# EAGLE design Block_Template (EAGLE 7.3.0)

## Sheet 1 of 2
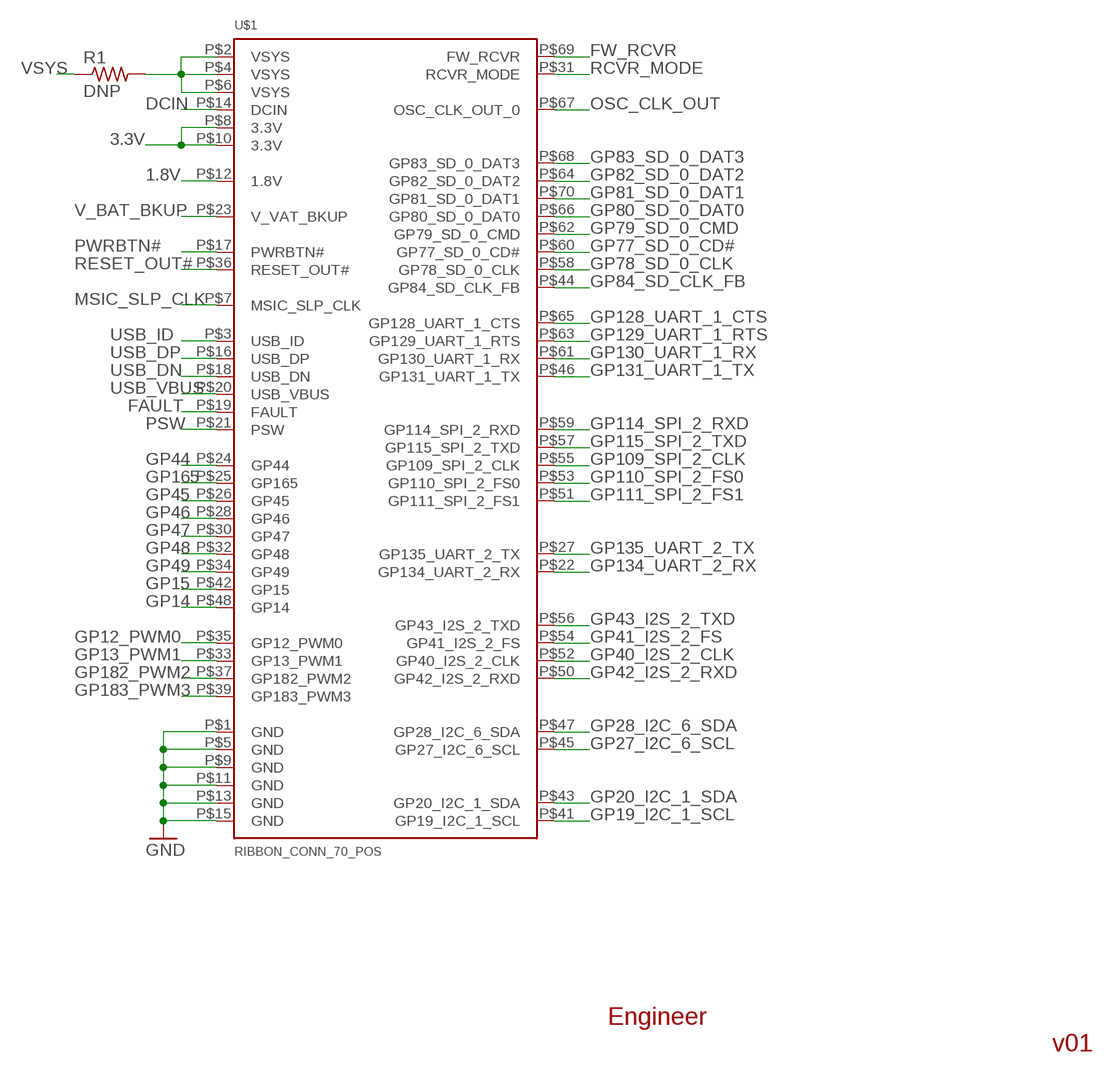
[diagram p0: schematic, sheet 1]

### Parts
R1  DNP  R-US_R0402  [R0402]
U$1  RIBBON_CONN_70_POS  [RIBBON_CONN_70_POS]

### Nets
1.8V: U$1.P$12(1.8V) ; also sheet 2
3.3V: U$1.P$8(3.3V) U$1.P$10(3.3V) ; also sheet 2
DCIN: U$1.P$14(DCIN) ; also sheet 2
FAULT: U$1.P$19(FAULT) ; also sheet 2
FW_RCVR: U$1.P$69(FW_RCVR) ; also sheet 2
GND: U$1.P$1(GND) U$1.P$5(GND) U$1.P$9(GND) U$1.P$11(GND) U$1.P$13(GND) U$1.P$15(GND) ; also sheet 2
GP12_PWM0: U$1.P$35(GP12_PWM0) ; also sheet 2
GP13_PWM1: U$1.P$33(GP13_PWM1) ; also sheet 2
GP14: U$1.P$48(GP14) ; also sheet 2
GP15: U$1.P$42(GP15) ; also sheet 2
GP19_I2C_1_SCL: U$1.P$41(GP19_I2C_1_SCL) ; also sheet 2
GP20_I2C_1_SDA: U$1.P$43(GP20_I2C_1_SDA) ; also sheet 2
GP27_I2C_6_SCL: U$1.P$45(GP27_I2C_6_SCL) ; also sheet 2
GP28_I2C_6_SDA: U$1.P$47(GP28_I2C_6_SDA) ; also sheet 2
GP40_I2S_2_CLK: U$1.P$52(GP40_I2S_2_CLK) ; also sheet 2
GP41_I2S_2_FS: U$1.P$54(GP41_I2S_2_FS) ; also sheet 2
GP42_I2S_2_RXD: U$1.P$50(GP42_I2S_2_RXD) ; also sheet 2
GP43_I2S_2_TXD: U$1.P$56(GP43_I2S_2_TXD) ; also sheet 2
GP44: U$1.P$24(GP44) ; also sheet 2
GP45: U$1.P$26(GP45) ; also sheet 2
GP46: U$1.P$28(GP46) ; also sheet 2
GP47: U$1.P$30(GP47) ; also sheet 2
GP48: U$1.P$32(GP48) ; also sheet 2
GP49: U$1.P$34(GP49) ; also sheet 2
GP77_SD_0_CD#: U$1.P$60(GP77_SD_0_CD#) ; also sheet 2
GP78_SD_0_CLK: U$1.P$58(GP78_SD_0_CLK) ; also sheet 2
GP79_SD_0_CMD: U$1.P$62(GP79_SD_0_CMD) ; also sheet 2
GP80_SD_0_DAT0: U$1.P$66(GP80_SD_0_DAT0) ; also sheet 2
GP81_SD_0_DAT1: U$1.P$70(GP81_SD_0_DAT1) ; also sheet 2
GP82_SD_0_DAT2: U$1.P$64(GP82_SD_0_DAT2) ; also sheet 2
GP83_SD_0_DAT3: U$1.P$68(GP83_SD_0_DAT3) ; also sheet 2
GP84_SD_CLK_FB: U$1.P$44(GP84_SD_CLK_FB) ; also sheet 2
GP109_SPI_2_CLK: U$1.P$55(GP109_SPI_2_CLK) ; also sheet 2
GP110_SPI_2_FS0: U$1.P$53(GP110_SPI_2_FS0) ; also sheet 2
GP111_SPI_2_FS1: U$1.P$51(GP111_SPI_2_FS1) ; also sheet 2
GP114_SPI_2_RXD: U$1.P$59(GP114_SPI_2_RXD) ; also sheet 2
GP115_SPI_2_TXD: U$1.P$57(GP115_SPI_2_TXD) ; also sheet 2
GP128_UART_1_CTS: U$1.P$65(GP128_UART_1_CTS) ; also sheet 2
GP129_UART_1_RTS: U$1.P$63(GP129_UART_1_RTS) ; also sheet 2
GP130_UART_1_RX: U$1.P$61(GP130_UART_1_RX) ; also sheet 2
GP131_UART_1_TX: U$1.P$46(GP131_UART_1_TX) ; also sheet 2
GP134_UART_2_RX: U$1.P$22(GP134_UART_2_RX) ; also sheet 2
GP135_UART_2_TX: U$1.P$27(GP135_UART_2_TX) ; also sheet 2
GP165: U$1.P$25(GP165) ; also sheet 2
GP182_PWM2: U$1.P$37(GP182_PWM2) ; also sheet 2
GP183_PWM3: U$1.P$39(GP183_PWM3) ; also sheet 2
MSIC_SLP_CLK: U$1.P$7(MSIC_SLP_CLK) ; also sheet 2
N$2: R1.2 U$1.P$2(VSYS) U$1.P$4(VSYS) U$1.P$6(VSYS)
OSC_CLK_OUT: U$1.P$67(OSC_CLK_OUT_0) ; also sheet 2
PSW: U$1.P$21(PSW) ; also sheet 2
PWRBTN#: U$1.P$17(PWRBTN#) ; also sheet 2
RCVR_MODE: U$1.P$31(RCVR_MODE) ; also sheet 2
RESET_OUT#: U$1.P$36(RESET_OUT#) ; also sheet 2
USB_DN: U$1.P$18(USB_DN) ; also sheet 2
USB_DP: U$1.P$16(USB_DP) ; also sheet 2
USB_ID: U$1.P$3(USB_ID) ; also sheet 2
USB_VBUS: U$1.P$20(USB_VBUS) ; also sheet 2
V_BAT_BKUP: U$1.P$23(V_VAT_BKUP) ; also sheet 2
VSYS: R1.1 ; also sheet 2

### Notes on the sheet
- Engineer
- v01

## Sheet 2 of 2
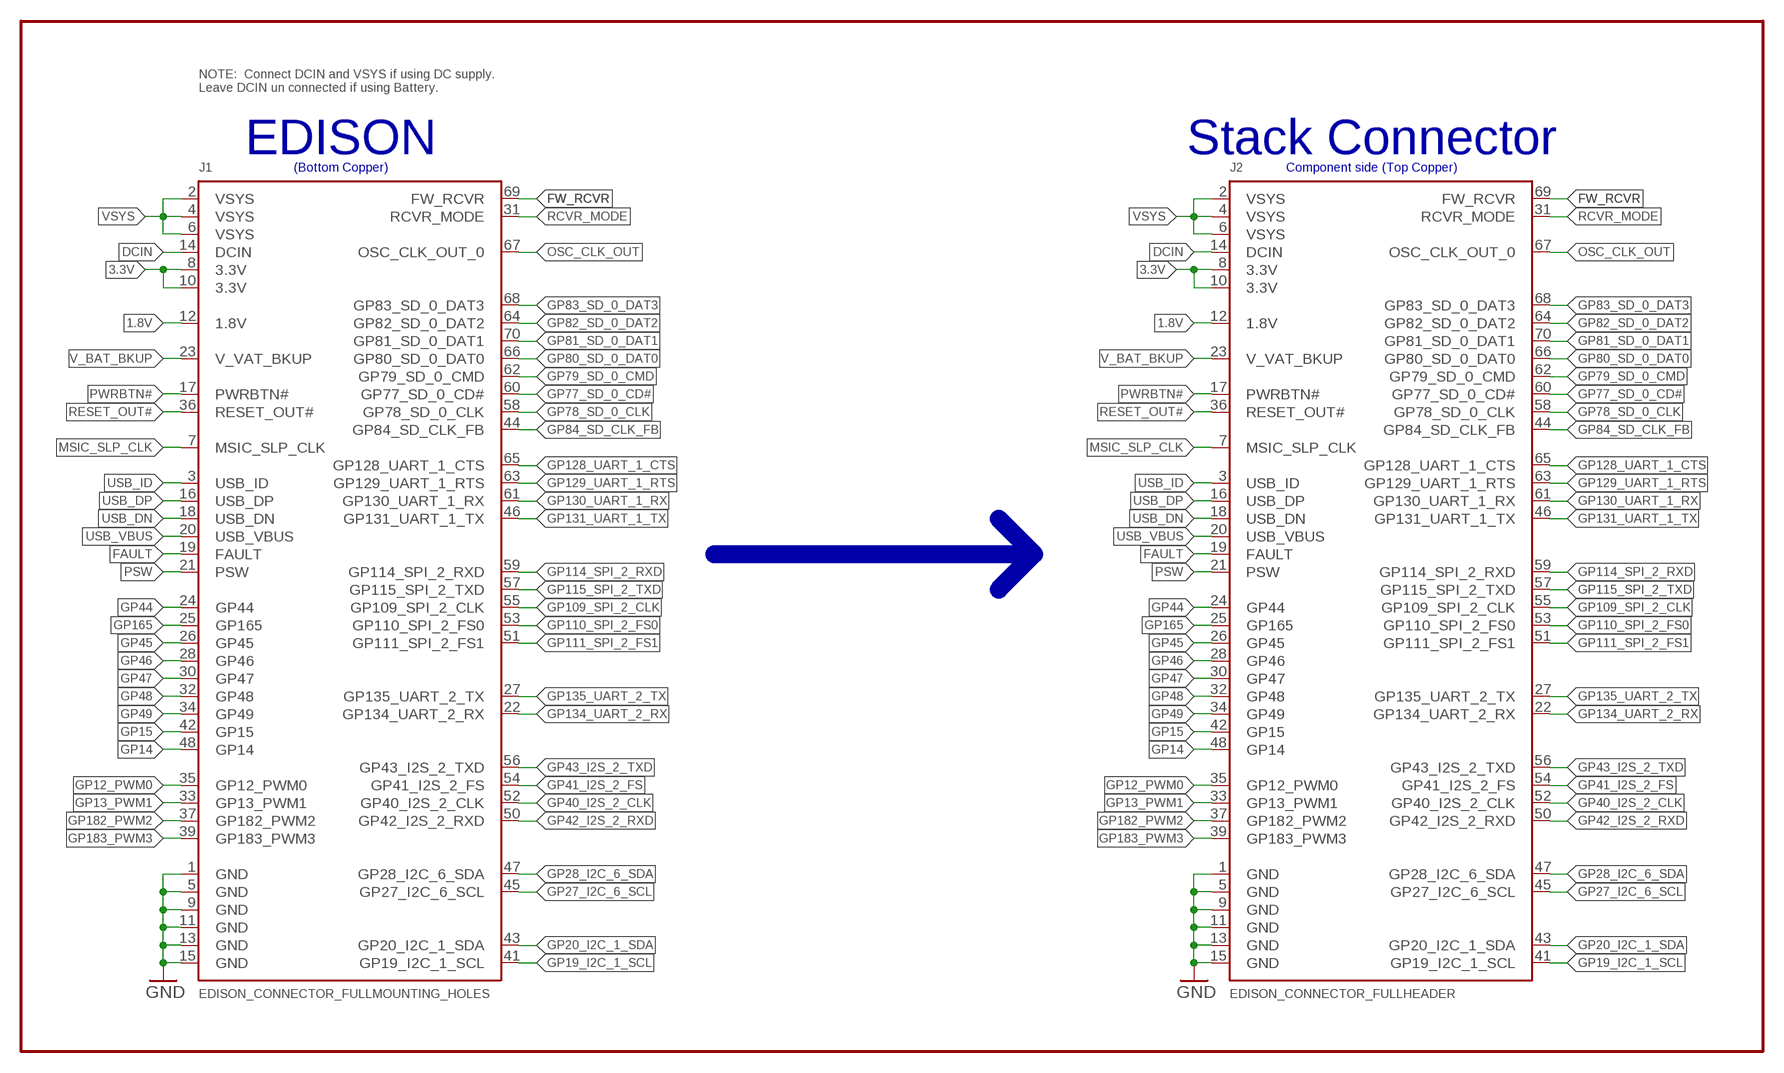
[diagram p1: schematic, sheet 2]

### Parts
J1  EDISON_CONNECTOR_FULLMOUNTING_HOLES  [EDISON_DAUGHTER]
J2  EDISON_CONNECTOR_FULLHEADER  [DF40C-70DP-0.4(51)]

### Nets
1.8V: J1.12(1.8V) J2.12(1.8V) ; also sheet 1
3.3V: J1.8(3.3V) J1.10(3.3V) J2.8(3.3V) J2.10(3.3V) ; also sheet 1
DCIN: J1.14(DCIN) J2.14(DCIN) ; also sheet 1
FAULT: J1.19(FAULT) J2.19(FAULT) ; also sheet 1
FW_RCVR: J1.69(FW_RCVR) J2.69(FW_RCVR) ; also sheet 1
GND: J1.1(GND) J1.5(GND) J1.9(GND) J1.11(GND) J1.13(GND) J1.15(GND) J2.1(GND) J2.5(GND) J2.9(GND) J2.11(GND) J2.13(GND) J2.15(GND) ; also sheet 1
GP12_PWM0: J1.35(GP12_PWM0) J2.35(GP12_PWM0) ; also sheet 1
GP13_PWM1: J1.33(GP13_PWM1) J2.33(GP13_PWM1) ; also sheet 1
GP14: J1.48(GP14) J2.48(GP14) ; also sheet 1
GP15: J1.42(GP15) J2.42(GP15) ; also sheet 1
GP19_I2C_1_SCL: J1.41(GP19_I2C_1_SCL) J2.41(GP19_I2C_1_SCL) ; also sheet 1
GP20_I2C_1_SDA: J1.43(GP20_I2C_1_SDA) J2.43(GP20_I2C_1_SDA) ; also sheet 1
GP27_I2C_6_SCL: J1.45(GP27_I2C_6_SCL) J2.45(GP27_I2C_6_SCL) ; also sheet 1
GP28_I2C_6_SDA: J1.47(GP28_I2C_6_SDA) J2.47(GP28_I2C_6_SDA) ; also sheet 1
GP40_I2S_2_CLK: J1.52(GP40_I2S_2_CLK) J2.52(GP40_I2S_2_CLK) ; also sheet 1
GP41_I2S_2_FS: J1.54(GP41_I2S_2_FS) J2.54(GP41_I2S_2_FS) ; also sheet 1
GP42_I2S_2_RXD: J1.50(GP42_I2S_2_RXD) J2.50(GP42_I2S_2_RXD) ; also sheet 1
GP43_I2S_2_TXD: J1.56(GP43_I2S_2_TXD) J2.56(GP43_I2S_2_TXD) ; also sheet 1
GP44: J1.24(GP44) J2.24(GP44) ; also sheet 1
GP45: J1.26(GP45) J2.26(GP45) ; also sheet 1
GP46: J1.28(GP46) J2.28(GP46) ; also sheet 1
GP47: J1.30(GP47) J2.30(GP47) ; also sheet 1
GP48: J1.32(GP48) J2.32(GP48) ; also sheet 1
GP49: J1.34(GP49) J2.34(GP49) ; also sheet 1
GP77_SD_0_CD#: J1.60(GP77_SD_0_CD#) J2.60(GP77_SD_0_CD#) ; also sheet 1
GP78_SD_0_CLK: J1.58(GP78_SD_0_CLK) J2.58(GP78_SD_0_CLK) ; also sheet 1
GP79_SD_0_CMD: J1.62(GP79_SD_0_CMD) J2.62(GP79_SD_0_CMD) ; also sheet 1
GP80_SD_0_DAT0: J1.66(GP80_SD_0_DAT0) J2.66(GP80_SD_0_DAT0) ; also sheet 1
GP81_SD_0_DAT1: J1.70(GP81_SD_0_DAT1) J2.70(GP81_SD_0_DAT1) ; also sheet 1
GP82_SD_0_DAT2: J1.64(GP82_SD_0_DAT2) J2.64(GP82_SD_0_DAT2) ; also sheet 1
GP83_SD_0_DAT3: J1.68(GP83_SD_0_DAT3) J2.68(GP83_SD_0_DAT3) ; also sheet 1
GP84_SD_CLK_FB: J1.44(GP84_SD_CLK_FB) J2.44(GP84_SD_CLK_FB) ; also sheet 1
GP109_SPI_2_CLK: J1.55(GP109_SPI_2_CLK) J2.55(GP109_SPI_2_CLK) ; also sheet 1
GP110_SPI_2_FS0: J1.53(GP110_SPI_2_FS0) J2.53(GP110_SPI_2_FS0) ; also sheet 1
GP111_SPI_2_FS1: J1.51(GP111_SPI_2_FS1) J2.51(GP111_SPI_2_FS1) ; also sheet 1
GP114_SPI_2_RXD: J1.59(GP114_SPI_2_RXD) J2.59(GP114_SPI_2_RXD) ; also sheet 1
GP115_SPI_2_TXD: J1.57(GP115_SPI_2_TXD) J2.57(GP115_SPI_2_TXD) ; also sheet 1
GP128_UART_1_CTS: J1.65(GP128_UART_1_CTS) J2.65(GP128_UART_1_CTS) ; also sheet 1
GP129_UART_1_RTS: J1.63(GP129_UART_1_RTS) J2.63(GP129_UART_1_RTS) ; also sheet 1
GP130_UART_1_RX: J1.61(GP130_UART_1_RX) J2.61(GP130_UART_1_RX) ; also sheet 1
GP131_UART_1_TX: J1.46(GP131_UART_1_TX) J2.46(GP131_UART_1_TX) ; also sheet 1
GP134_UART_2_RX: J1.22(GP134_UART_2_RX) J2.22(GP134_UART_2_RX) ; also sheet 1
GP135_UART_2_TX: J1.27(GP135_UART_2_TX) J2.27(GP135_UART_2_TX) ; also sheet 1
GP165: J1.25(GP165) J2.25(GP165) ; also sheet 1
GP182_PWM2: J1.37(GP182_PWM2) J2.37(GP182_PWM2) ; also sheet 1
GP183_PWM3: J1.39(GP183_PWM3) J2.39(GP183_PWM3) ; also sheet 1
MSIC_SLP_CLK: J1.7(MSIC_SLP_CLK) J2.7(MSIC_SLP_CLK) ; also sheet 1
OSC_CLK_OUT: J1.67(OSC_CLK_OUT_0) J2.67(OSC_CLK_OUT_0) ; also sheet 1
PSW: J1.21(PSW) J2.21(PSW) ; also sheet 1
PWRBTN#: J1.17(PWRBTN#) J2.17(PWRBTN#) ; also sheet 1
RCVR_MODE: J1.31(RCVR_MODE) J2.31(RCVR_MODE) ; also sheet 1
RESET_OUT#: J1.36(RESET_OUT#) J2.36(RESET_OUT#) ; also sheet 1
USB_DN: J1.18(USB_DN) J2.18(USB_DN) ; also sheet 1
USB_DP: J1.16(USB_DP) J2.16(USB_DP) ; also sheet 1
USB_ID: J1.3(USB_ID) J2.3(USB_ID) ; also sheet 1
USB_VBUS: J1.20(USB_VBUS) J2.20(USB_VBUS) ; also sheet 1
V_BAT_BKUP: J1.23(V_VAT_BKUP) J2.23(V_VAT_BKUP) ; also sheet 1
VSYS: J1.2(VSYS) J1.4(VSYS) J1.6(VSYS) J2.2(VSYS) J2.4(VSYS) J2.6(VSYS) ; also sheet 1

### Buses
B$1

### Notes on the sheet
- NOTE:  Connect DCIN and VSYS if using DC supply.
  Leave DCIN un connected if using Battery.
- EDISON | Stack Connector
- (Bottom Copper) | Component side (Top Copper)

## Library data of the parts
J1 J2 = Edison:EDISON_CONNECTOR_FULL
R1 = rcl:R-US_: RESISTOR, American symbol
U$1 = kinetic:RIBBON_CONN_70_POS

## Board
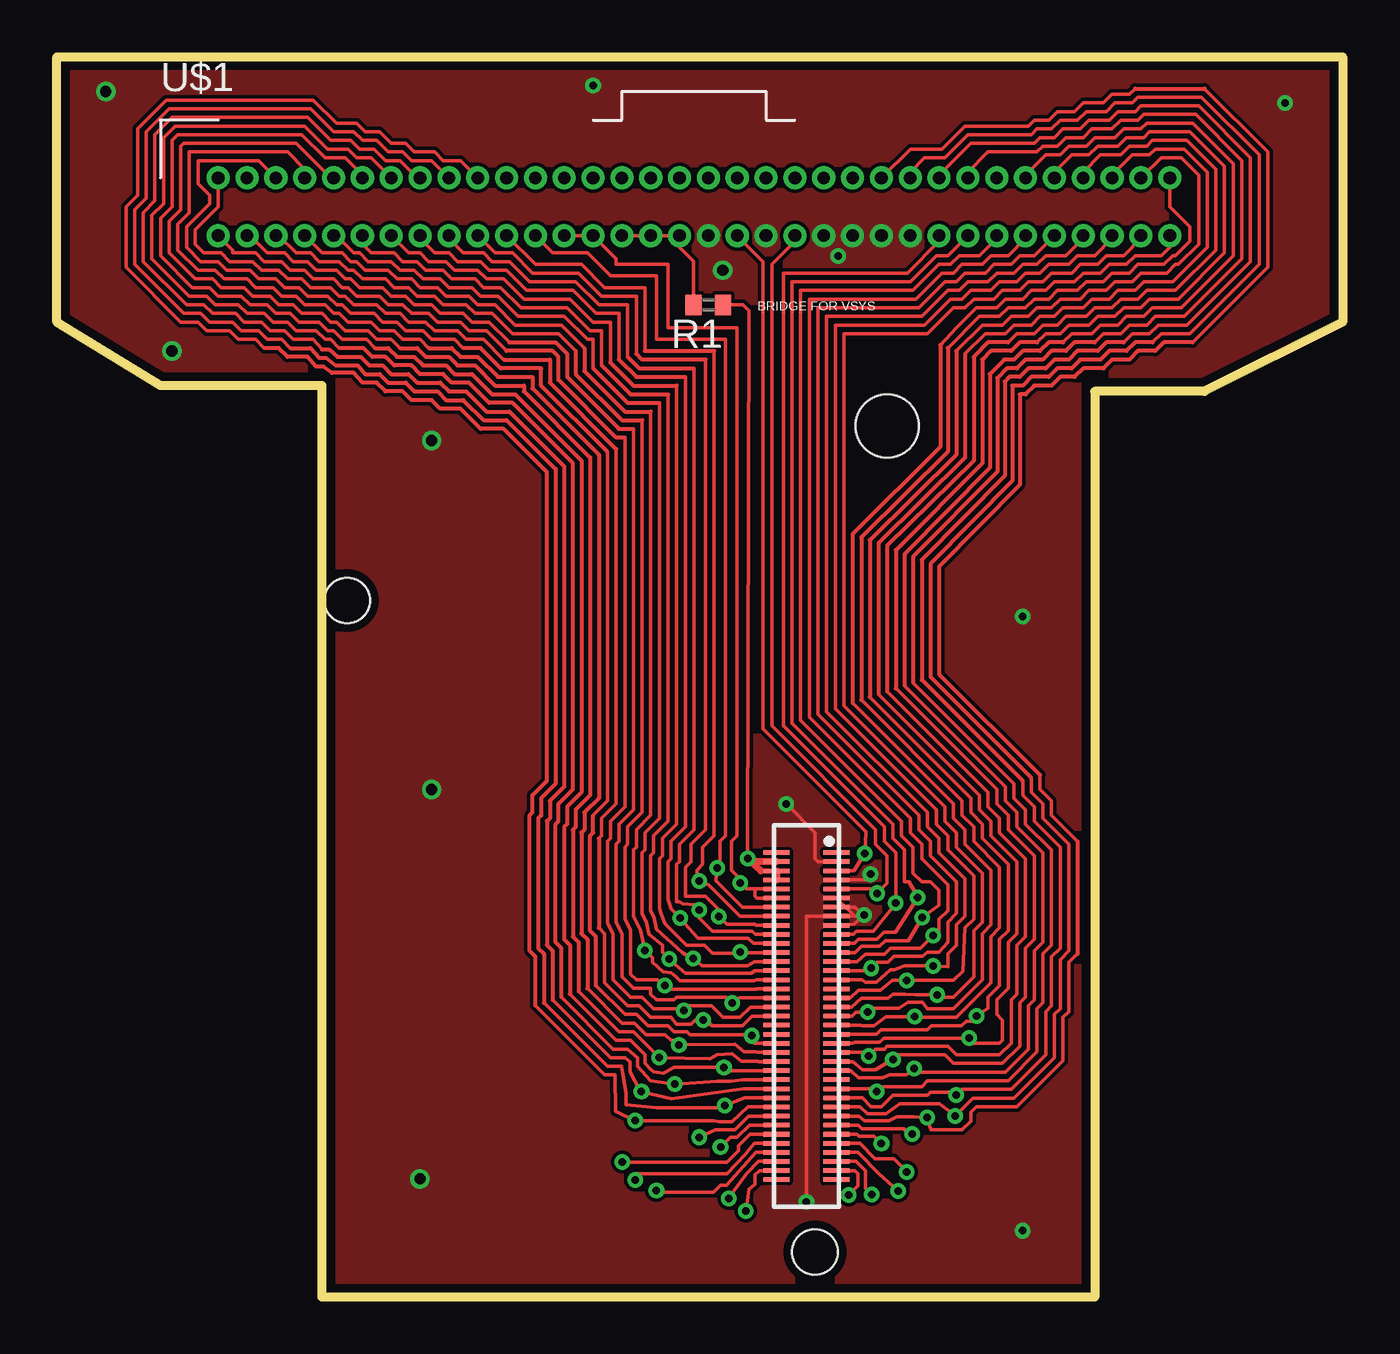
[diagram p2: board, top side]
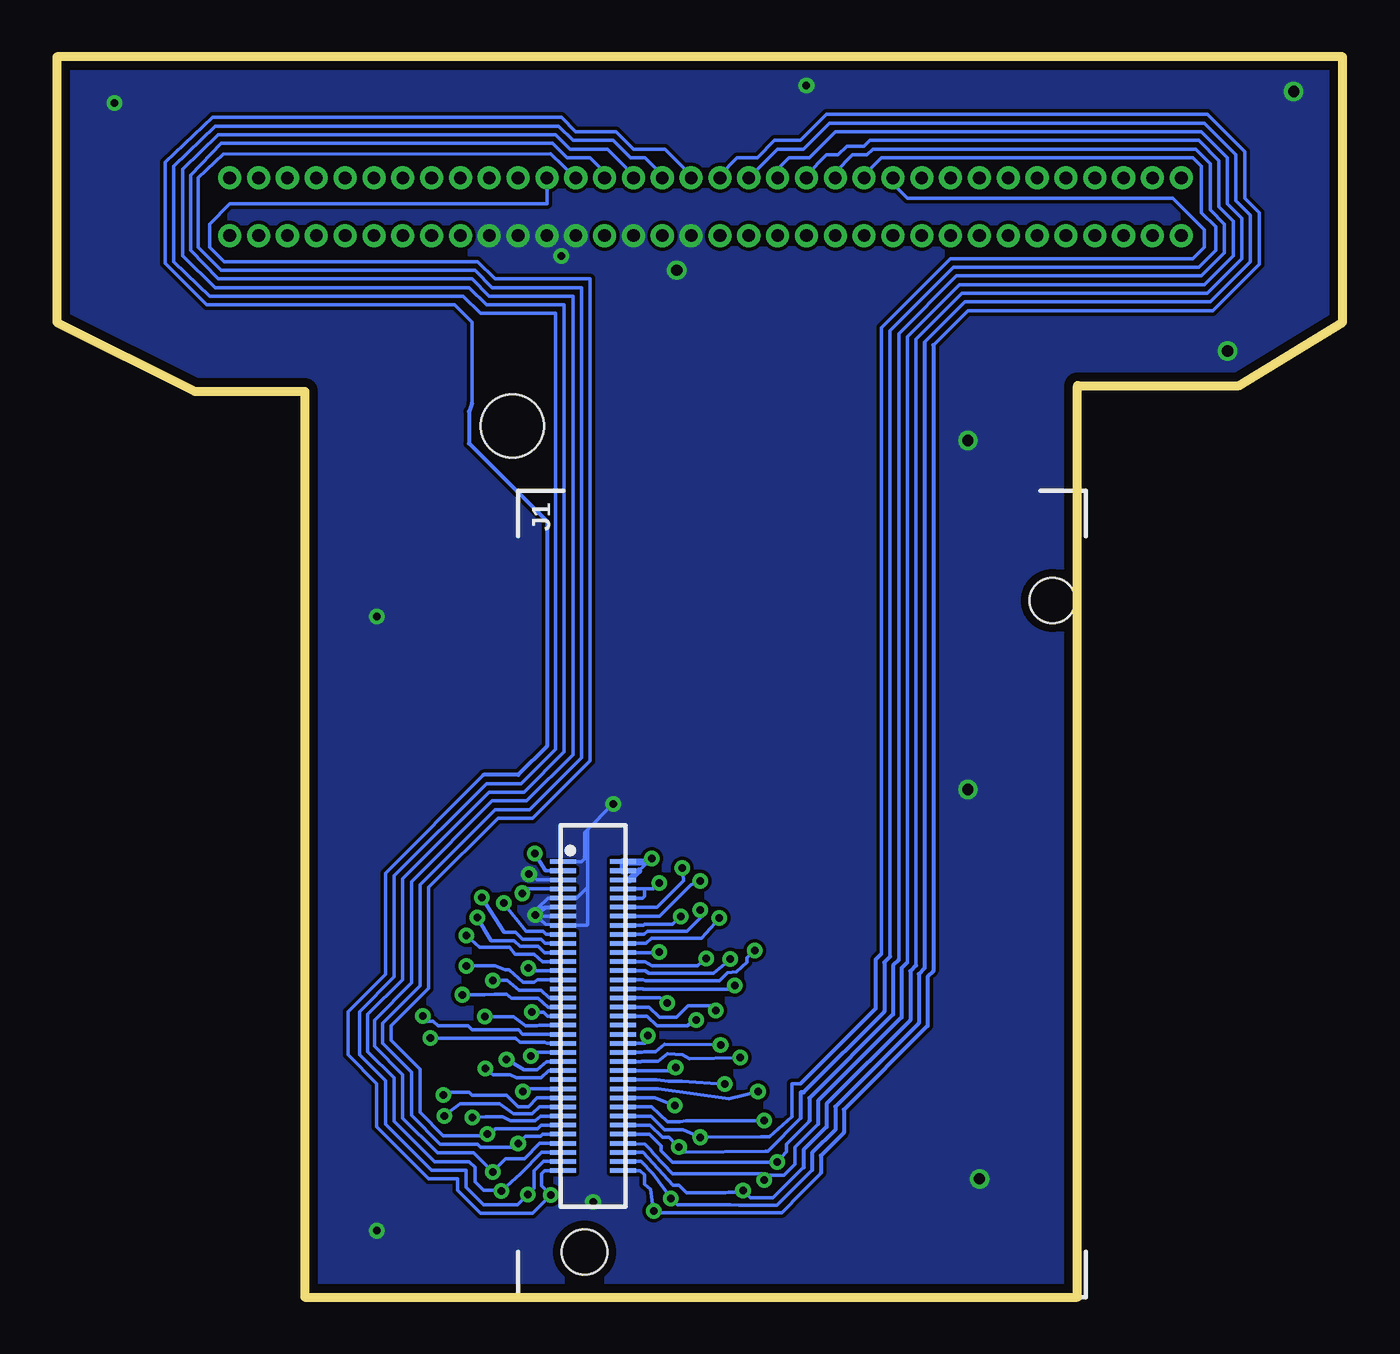
[diagram p3: board, bottom side, seen from below]

Size 56.64 x 54.61 mm. Coordinates in mm from the lower left corner, seen from the top.
Outline: 45.72,39.88 45.72,0 11.68,0 11.68,40.13 4.57,40.13 0,42.93 0,54.61 56.64,54.61 56.64,42.93 50.55,39.88 45.72,39.88
Copper layers (1*16): Top 0.035mm / dielectric 1.5mm / Bottom 0.035mm
Design rules "SparkFun-2-layer *": minimum track width 6mil, minimum drill 13mil, track to track 6mil, track to pad 6mil, pad to pad 6mil, via to via 6mil, smd to smd 6mil, copper to edge 15mil, drill to drill 7mil, minimum pad ring 8mil, minimum via ring 7mil, stop-mask expansion 4mil, vias tented up to drill 20mil, thermal gap 6mil
Holes 2.8 mm at 36.58,38.35

### Footprints (pad centres in the part's own frame; a part is rotated, then mirrored left to right if it is on the bottom)
EDISON_DAUGHTER = smd 1.14 x 0.2: 1 1.98,19.17; 2 4.62,19.17; 3 1.98,18.77; 4 4.62,18.77; 5 1.98,18.37; 6 4.62,18.37; 7 1.98,17.97; 8 4.62,17.97; 9 1.98,17.57; 10 4.62,17.57; 11 1.98,17.17; 12 4.62,17.17; 13 1.98,16.77; 14 4.62,16.77; 15 1.98,16.37; 16 4.62,16.37; 17 1.98,15.97; 18 4.62,15.97; 19 1.98,15.57; 20 4.62,15.57; 21 1.98,15.17; 22 4.62,15.17; 23 1.98,14.77; 24 4.62,14.77; 25 1.98,14.37; 26 4.62,14.37; 27 1.98,13.97; 28 4.62,13.97; 29 1.98,13.57; 30 4.62,13.57; 31 1.98,13.17; 32 4.62,13.17; 33 1.98,12.77; 34 4.62,12.77; 35 1.98,12.37; 36 4.62,12.37; 37 1.98,11.97; 38 4.62,11.97; 39 1.98,11.57; 40 4.62,11.57; 41 1.98,11.17; 42 4.62,11.17; 43 1.98,10.77; 44 4.62,10.77; 45 1.98,10.37; 46 4.62,10.37; 47 1.98,9.97; 48 4.62,9.97; 49 1.98,9.57; 50 4.62,9.57; 51 1.98,9.17; 52 4.62,9.17; 53 1.98,8.77; 54 4.62,8.77; 55 1.98,8.37; 56 4.62,8.37; 57 1.98,7.97; 58 4.62,7.97; 59 1.98,7.57; 60 4.62,7.57; 61 1.98,7.17; 62 4.62,7.17; 63 1.98,6.77; 64 4.62,6.77; 65 1.98,6.37; 66 4.62,6.37; 67 1.98,5.97; 68 4.62,5.97; 69 1.98,5.57; 70 4.62,5.57 | hole 2: 23.53,30.67; 2.93,1.98
DF40C-70DP-0.4(51) = smd 0.2 x 1.14 bottom: 1 6.8,1.32; 2 6.8,-1.32; 3 6.4,1.32; 4 6.4,-1.32; 5 6,1.32; 6 6,-1.32; 7 5.6,1.32; 8 5.6,-1.32; 9 5.2,1.32; 10 5.2,-1.32; 11 4.8,1.32; 12 4.8,-1.32; 13 4.4,1.32; 14 4.4,-1.32; 15 4,1.32; 16 4,-1.32; 17 3.6,1.32; 18 3.6,-1.32; 19 3.2,1.32; 20 3.2,-1.32; 21 2.8,1.32; 22 2.8,-1.32; 23 2.4,1.32; 24 2.4,-1.32; 25 2,1.32; 26 2,-1.32; 27 1.6,1.32; 28 1.6,-1.32; 29 1.2,1.32; 30 1.2,-1.32; 31 0.8,1.32; 32 0.8,-1.32; 33 0.4,1.32; 34 0.4,-1.32; 35 0,1.32; 36 0,-1.32; 37 -0.4,1.32; 38 -0.4,-1.32; 39 -0.8,1.32; 40 -0.8,-1.32; 41 -1.2,1.32; 42 -1.2,-1.32; 43 -1.6,1.32; 44 -1.6,-1.32; 45 -2,1.32; 46 -2,-1.32; 47 -2.4,1.32; 48 -2.4,-1.32; 49 -2.8,1.32; 50 -2.8,-1.32; 51 -3.2,1.32; 52 -3.2,-1.32; 53 -3.6,1.32; 54 -3.6,-1.32; 55 -4,1.32; 56 -4,-1.32; 57 -4.4,1.32; 58 -4.4,-1.32; 59 -4.8,1.32; 60 -4.8,-1.32; 61 -5.2,1.32; 62 -5.2,-1.32; 63 -5.6,1.32; 64 -5.6,-1.32; 65 -6,1.32; 66 -6,-1.32; 67 -6.4,1.32; 68 -6.4,-1.32; 69 -6.8,1.32; 70 -6.8,-1.32; NC1 7.2,1.32; NC2 7.2,-1.32; NC3 -7.2,-1.32; NC4 -7.2,1.32
R0402 = smd 0.7 x 0.9: 1 -0.65,0; 2 0.65,0
RIBBON_CONN_70_POS = drill 0.559 pad 1.016: P$1 0,-1.27; P$2 -1.27,-1.27; P$3 1.27,-1.27; P$4 -2.54,-1.27; P$5 2.54,-1.27; P$6 -3.81,-1.27; P$7 3.81,-1.27; P$8 -5.08,-1.27; P$9 5.08,-1.27; P$10 -6.35,-1.27; P$11 6.35,-1.27; P$12 -7.62,-1.27; P$13 7.62,-1.27; P$14 -8.89,-1.27; P$15 8.89,-1.27; P$16 -10.16,-1.27; P$17 10.16,-1.27; P$18 -11.43,-1.27; P$19 11.43,-1.27; P$20 -12.7,-1.27; P$21 12.7,-1.27; P$22 -13.97,-1.27; P$23 13.97,-1.27; P$24 -15.24,-1.27; P$25 15.24,-1.27; P$26 -16.51,-1.27; P$27 16.51,-1.27; P$28 -17.78,-1.27; P$30 -19.05,-1.27; P$31 17.78,-1.27; P$32 -20.32,-1.27; P$33 19.05,-1.27; P$34 -21.59,-1.27; P$35 20.32,-1.27; P$36 -21.59,1.27; P$37 20.32,1.27; P$39 19.05,1.27; P$40 -20.32,1.27; P$41 17.78,1.27; P$42 -19.05,1.27; P$43 16.51,1.27; P$44 -17.78,1.27; P$45 15.24,1.27; P$46 -16.51,1.27; P$47 13.97,1.27; P$48 -15.24,1.27; P$49 12.7,1.27; P$50 -13.97,1.27; P$51 11.43,1.27; P$52 -12.7,1.27; P$53 10.16,1.27; P$54 -11.43,1.27; P$55 8.89,1.27; P$56 -10.16,1.27; P$57 7.62,1.27; P$58 -8.89,1.27; P$59 6.35,1.27; P$60 -7.62,1.27; P$61 5.08,1.27; P$62 -6.35,1.27; P$63 3.81,1.27; P$64 -5.08,1.27; P$65 2.54,1.27; P$66 -3.81,1.27; P$67 1.27,1.27; P$68 -2.54,1.27; P$69 0,1.27; P$70 -1.27,1.27

### Placement (x,y rotation side)
J1  36.32,0 0 bottom
J2  33.02,12.37 90 bottom
R1  28.7,43.69 180 top
U$1  28.7,48.01 0 top

### Tracks (layer width: path | path; a pad name or v marks a point on that pad's centre or on a via)
1.8V  (via drill 0.33)
  Top 0.152: J1.12 30.2,17.17 29.03,18.34 v29.08,18.9 29.21,19.07 29.21,20.07 29.46,20.32 29.46,42.16 26.42,42.16 26.42,44.96 24.38,44.96 23.37,45.97 21.84,45.97 U$1.P$12
  Bottom 0.152: v29.08,18.9 29.03,18.34 30.2,17.17 J1.12 | J1.12
3.3V  (via drill 0.33)
  Top 0.152: J1.8 | 30.76,17.97 30.37,17.97 v30.1,18.24 30.1,18.41 29.72,18.8 29.72,20.07 29.97,20.32 29.97,42.67 26.92,42.67 26.92,45.47 24.64,45.47 24.64,45.72 U$1.P$8 U$1.P$10 | 30.76,17.97 J1.8 | J1.10 30.84,17.57 30.76,17.65 30.76,17.97
  Bottom 0.152: J1.8 30.76,17.97 | 30.76,17.97 30.37,17.97 v30.1,18.24 | J1.10 30.84,17.57 30.76,17.65 30.76,17.97
DCIN  (via drill 0.33)
  Top 0.152: J1.14 30.18,16.77 | 30.18,16.77 30.09,16.77 28.7,18.16 v28.3,18.31 28.19,18.21 28.19,18.8 28.45,19.05 28.45,19.81 28.96,20.32 28.96,41.66 | 30.18,16.77 | U$1.P$14 21.08,45.47 23.11,45.47 24.13,44.45 25.91,44.45 25.91,41.66
  Top 0.178: 25.91,41.66 28.96,41.66
  Bottom 0.152: v28.3,18.31 28.7,18.16 30.09,16.77 J1.14
FAULT  (via drill 0.33)
  Top 0.152: J2.19 35.13,15.57 35.31,15.75 36.12,15.75 36.42,16.05 36.93,16.05 v37.92,17.6 37.54,18.29 37.34,18.29 37.34,19.68 36.83,20.19 36.83,20.83 32.39,25.27 32.39,44.7 37.59,44.7 38.73,45.85 39.24,45.85 U$1.P$19
  Bottom 0.152: v37.92,17.6 36.93,16.05 36.42,16.05 36.12,15.75 35.31,15.75 35.13,15.57 J2.19
FW_RCVR  (via drill 0.33)
  Top 0.152: v34.87,4.5 35.28,4.9 35.28,5.44 35.15,5.57 J2.69
  Bottom 0.152: J2.69 35.15,5.57 35.28,5.44 35.28,4.9 v34.87,4.5 35.69,3.68 37.97,3.68 38.99,4.7 38.99,5.21 40.26,5.21 42.55,7.49 42.55,9.4 43.82,10.67 43.82,12.57 42.16,14.22 42.16,18.67 37.85,22.99 | U$1.P$69 28.7,49.4 29.84,50.55 31.24,50.55 32,51.31 33.78,51.31 34.42,51.94 49.78,51.94 51.87,49.96 51.87,45.52 50.04,43.69 39.12,43.69 38.35,42.93 38.35,39.37
  Bottom 0.178: 38.35,39.37 38.48,38.99 38.48,37.59 35.05,34.16 35.05,24.26 36.32,22.99 37.85,22.99
GND  (via drill 0.33, 0.33 pad 0.25, 0.5)
  Top 0.152: 35.33,18.37 35.33,18.36 | 35.33,18.37 35.74,18.37 v35.84,18.62 | 35.33,18.37 J2.5 | J2.1 33.54,19.17 33.4,19.3 33.4,20.45 v32.13,21.72 | J2.15 35.12,16.42 v35.56,16.82 34.4,16.71 J2.13 33.03,16.77 33.02,16.76 v33.02,4.19 | J2.11 35.15,17.17 35.56,16.76 35.15,16.76 J2.9
  Bottom 0.152: J2.1 33.54,19.17 33.4,19.3 33.4,20.45 v32.13,21.72 33.27,20.57 33.27,18.03 | 33.27,18.03 33.27,16.38 33.29,16.37 J2.15 35.12,16.42 v35.56,16.82 | 33.27,18.03 33.74,17.57 J2.9 35.01,17.57 35.43,17.14 34.37,17.14 J2.11 | J2.13 35.45,16.77 v35.56,16.82 | J2.11 35.05,17.17 v35.56,16.82 | J2.11 35.15,17.17 35.56,16.76 | J2.5 35.49,18.37 v35.84,18.62
  other vias: 2.16,53.09 5.08,41.66 16.51,37.72 16.51,22.35 16,5.21 29.34,45.21 34.42,45.85 42.55,2.92 42.55,29.97 54.1,52.58 23.62,53.34
  pour Top (no thermals): 11.68,0 11.68,40.13 4.57,40.13 0,42.93 0,54.61 56.64,54.61 56.64,42.93 50.55,39.88 45.72,39.88 45.72,0
  pour Bottom (no thermals): 11.68,0 11.68,40.13 4.57,40.13 0,42.93 0,54.61 56.64,54.61 56.64,42.93 50.55,39.88 45.72,39.88 45.72,0
GP12_PWM0  (via drill 0.33)
  Top 0.152: J2.35 35.03,12.37 35.2,12.55 v35.71,12.55 35.74,12.72 37.08,12.72 37.49,12.98 38.12,12.98 38.35,12.7 39.5,12.7 40.77,13.97 40.77,16 41.15,16.38 41.15,18.8 40.01,19.94 40.01,20.57 39.5,21.08 39.5,21.72 35.05,26.16 | U$1.P$35 49.02,46.23 48.64,45.85 47.5,45.85 47.12,45.47 46.36,45.47 45.97,45.09 45.21,45.09 44.83,44.7 43.94,44.7 43.56,44.32 42.93,44.32 42.55,43.94 41.78,43.94 41.4,43.56 40.51,43.56 39.62,42.67 38.91,41.91
  Top 0.178: 38.91,41.91 38.91,37.44 35.05,33.58 35.05,26.16
  Bottom 0.152: v35.71,12.55 35.2,12.55 35.03,12.37 J2.35 | J2.35
GP13_PWM1  (via drill 0.33)
  Top 0.152: J2.33 35,12.77 35.43,13.16 36.6,13.16 36.83,13.34 37.36,13.34 37.85,13.31 v38.79,13.31 38.84,13.21 39.5,13.21 40.39,14.1 40.39,16.13 40.77,16.51 40.77,18.67 39.62,19.81 39.62,20.45 39.12,20.95 39.12,21.59 34.67,26.04 34.67,42.42 38.35,42.42 39.5,43.56 40.01,43.56 40.39,43.94 41.28,43.94 41.66,44.32 42.42,44.32 42.8,44.7 43.43,44.7 43.82,45.09 44.7,45.09 45.09,45.47 45.85,45.47 46.23,45.85 46.99,45.85 47.75,46.61 U$1.P$33
  Bottom 0.152: J2.33 35,12.77 35.43,13.16 36.6,13.16 36.83,13.34 37.36,13.34 37.8,13.31 v38.79,13.31
GP14  (via drill 0.33)
  Top 0.152: v29.39,10.11 29.65,9.97 J1.48 | U$1.P$48 13.46,49.4 12.7,50.16 11.81,50.16 10.79,51.18 5.33,51.18 5.08,50.93 5.08,48.01 4.57,47.5 4.57,45.85 5.97,44.45 6.73,44.45 7.11,44.07 8.13,44.07 8.51,43.69 9.27,43.69 9.65,43.31 10.29,43.31 10.67,42.93 11.56,42.93 11.94,42.55 12.19,42.55 12.57,42.16 13.64,42.16 14.02,41.78 | 22.61,13.34 24.64,11.3 25.27,11.3 25.91,10.67 25.91,10.29 26.16,10.03 26.29,9.93 26.42,9.91 26.72,9.86 27.18,10.11 v29.39,10.11 | 29.44,10.11 v29.39,10.11
  Top 0.178: 14.02,41.78 14.61,41.78 14.99,41.4 15.75,41.4 16.13,41.02 17.14,41.02 17.53,40.64 18.29,40.64 19.18,39.75 20.19,39.75 23.11,36.83 23.11,22.23 22.48,21.59 22.48,20.83 22.35,20.7 22.35,15.75 22.61,15.49 22.61,13.34
  Bottom 0.152: J1.48 29.65,9.97 v29.39,10.11
GP15  (via drill 0.33)
  Top 0.152: J1.42 30.74,11.17 v30.61,11.51 30.35,11.56 27.89,11.56 27.76,11.68 27.18,11.68 26.92,11.94 26.04,11.94 25.53,12.45 25.02,12.45 23.75,13.72 | 23.62,21.21 24.26,21.84 24.26,37.21 | 17.91,41.78 17.53,42.16 16.51,42.16 16.13,42.55 15.37,42.55 14.99,42.93 14.35,42.93 13.97,43.31 12.95,43.31 12.57,43.69 12.32,43.69 11.94,44.07 11.05,44.07 10.67,44.45 10.03,44.45 9.65,44.83 8.89,44.83 8.51,45.21 7.49,45.21 7.11,45.59 6.35,45.59 5.71,46.23 5.71,47.12 6.73,48.13 6.73,48.51 6.22,49.02 6.22,50.04 8.89,50.04 U$1.P$42
  Top 0.178: 23.75,13.72 23.75,15.88 23.49,16.13 23.49,20.32 23.62,20.45 23.62,21.21 | 24.26,37.21 21.34,40.13 21.34,40.89 19.56,40.89 18.67,41.78 17.91,41.78
  Bottom 0.152: v30.61,11.51 30.74,11.17 J1.42
GP19_I2C_1_SCL  (via drill 0.33)
  Top 0.152: J2.41 35.05,11.17 35.15,11.23 36.25,11.23 36.42,11.4 v40.18,11.4 40.18,11.18 41.53,11.18 41.66,11.3 41.66,12.19 41.4,12.45 41.4,13.08 41.91,13.59 41.91,15.62 42.29,16 42.29,19.18 41.15,20.32 41.15,20.95 40.64,21.46 40.64,22.1 36.2,26.54 | U$1.P$41 46.48,49.4 47.37,50.29 48.13,50.29 48.39,50.55 49.66,50.55 50.67,49.53 50.67,46.23 49.15,44.7 47.88,44.7 47.5,44.32 46.74,44.32 46.36,43.94 45.59,43.94 45.21,43.56 44.32,43.56 43.94,43.18 43.31,43.18 42.93,42.8 42.16,42.8 41.78,42.42 40.89,42.42 40.01,41.53
  Top 0.178: 40.01,41.53 40.01,36.96 36.2,33.2 36.2,26.54
  Bottom 0.152: v40.18,11.4 36.42,11.4 36.25,11.23 35.15,11.23 35.05,11.17 J2.41
GP20_I2C_1_SDA  (via drill 0.33)
  Top 0.152: J2.43 35.61,10.77 v35.76,10.62 36.07,10.92 36.45,10.92 36.58,11.05 39.24,11.05 39.62,10.67 41.53,10.67 42.04,11.18 42.04,13.08 42.29,13.34 42.29,15.49 42.67,15.88 42.67,19.3 41.53,20.45 41.53,21.08 41.02,21.59 41.02,22.23 36.58,26.67 | U$1.P$43 45.21,49.53 45.97,50.29 46.86,50.29 47.24,50.67 48.01,50.67 48.26,50.93 49.78,50.93 51.05,49.66 51.05,46.1 49.28,44.32 48.01,44.32 47.62,43.94 46.86,43.94 46.48,43.56 45.72,43.56 45.34,43.18 44.45,43.18 44.07,42.8 43.43,42.8 43.05,42.42 42.29,42.42 41.91,42.04
  Top 0.178: 41.91,42.04 41.02,42.04 40.39,41.4 40.39,36.83 36.58,33.07 36.58,26.67
  Bottom 0.152: v35.76,10.62 35.61,10.77 J2.43 | J2.43
GP27_I2C_6_SCL  (via drill 0.33)
  Top 0.152: J2.45 35.07,10.37 35.48,10.01 36.07,10.01 v36.83,10.46 37.03,10.67 39.12,10.67 39.5,10.29 41.66,10.29 42.42,11.05 42.42,12.95 42.67,13.21 42.67,15.37 43.05,15.75 43.05,19.43 41.91,20.57 41.91,21.21 41.4,21.72 41.4,22.35 36.96,26.8 | U$1.P$45 43.94,49.53 44.7,50.29 45.47,50.29 45.85,50.67 46.74,50.67 47.12,51.05 47.88,51.05 48.13,51.31 49.91,51.31 51.44,49.78 51.44,45.97 49.4,43.94 48.13,43.94 47.75,43.56 46.99,43.56 46.61,43.18 45.85,43.18 45.47,42.8 44.58,42.8 44.2,42.42 43.56,42.42 43.18,42.04
  Top 0.178: 43.18,42.04 42.42,42.04 42.04,41.66 41.15,41.66 40.77,41.27 40.77,36.7 36.96,32.89 36.96,26.8
  Bottom 0.152: J2.45 35.07,10.37 35.48,10.01 36.07,10.01 v36.83,10.46
GP28_I2C_6_SDA  (via drill 0.33)
  Top 0.152: J2.47 34.99,9.97 35.31,9.65 36.4,9.65 36.68,9.78 37.41,9.78 v37.77,10.06 37.82,9.91 41.78,9.91 42.8,10.92 42.8,12.83 43.05,13.08 43.05,15.24 43.43,15.62 43.43,19.56 42.29,20.7 42.29,21.34 41.78,21.84 41.78,22.48 37.34,26.92 | U$1.P$47 42.67,49.4 43.56,50.29 44.2,50.29 44.58,50.67 45.34,50.67 45.72,51.05 46.61,51.05 46.99,51.44 47.75,51.44 48.01,51.69 50.04,51.69 51.82,49.91 51.82,45.85 49.53,43.56 48.26,43.56 47.88,43.18 47.12,43.18 46.74,42.8 45.97,42.8 45.59,42.42 44.7,42.42 44.32,42.04
  Top 0.178: 44.32,42.04 43.69,42.04 43.31,41.66 42.55,41.66 42.16,41.27 41.73,41.27 41.1,40.64 41.1,36.52 37.34,32.72 37.34,26.92
  Bottom 0.152: v37.77,10.06 37.41,9.78 36.68,9.78 36.4,9.65 35.31,9.65 34.99,9.97 J2.47
GP40_I2S_2_CLK  (via drill 0.33)
  Top 0.152: J1.52 30.25,9.17 27.08,8.74 v25.76,9.04 25.68,9.09 25.25,9.93 25.25,10.36 25.02,10.54 24.38,10.54 21.84,13.08 | U$1.P$52 15.88,49.28 15.11,50.04 14.48,50.04 13.97,50.55 13.34,50.55 12.95,50.93 12.07,50.93 11.05,51.94 5.08,51.94 4.32,51.18 4.32,48.26 3.81,47.75 3.81,45.59 5.71,43.69 6.48,43.69 6.86,43.31 7.87,43.31 8.26,42.93 9.02,42.93 9.4,42.55 10.03,42.55 10.41,42.16 11.3,42.16 11.68,41.73
  Top 0.178: 11.68,41.73 11.99,41.73 12.37,41.4 13.39,41.4 13.77,41.02 14.35,41.02 14.73,40.64 15.49,40.64 15.88,40.26 16.89,40.26 17.27,39.88 18.03,39.88 18.92,38.99 19.94,38.99 22.35,36.58 22.35,22.48 21.72,21.84 21.72,21.08 21.59,20.95 21.59,15.49 21.84,15.24 21.84,13.08
  Bottom 0.152: v25.76,9.04 27.03,8.74 30.15,9.17 J1.52
GP41_I2S_2_FS  (via drill 0.33)
  Top 0.152: J1.54 30.28,8.77 29.69,8.53 v29.41,8.43 29.41,8.33 26.42,8.33 25.07,8.46 25.07,8.99 24.92,9.91 24.87,10.16 24.26,10.16 21.46,12.95 | U$1.P$54 16.51,50.04 15.62,50.04 15.24,50.42 14.61,50.42 14.1,50.93 13.46,50.93 13.08,51.31 12.19,51.31 11.18,52.32 4.95,52.32 3.94,51.31 3.94,48.39 3.43,47.88 3.43,45.47 5.59,43.31 6.35,43.31 6.73,42.93 7.75,42.93 8.13,42.55 8.89,42.55 9.27,42.16 9.91,42.16 10.29,41.78
  Top 0.178: 10.29,41.78 11.18,41.78 11.56,41.35 11.86,41.35 12.29,41.02 13.26,41.02 13.59,40.64 14.22,40.64 14.61,40.26 15.37,40.26 15.75,39.88 16.76,39.88 17.14,39.5 17.91,39.5 18.8,38.61 19.81,38.61 21.97,36.45 21.97,22.61 21.34,21.97 21.34,21.21 21.21,21.08 21.21,15.37 21.46,15.11 21.46,12.95
  Bottom 0.152: J1.54 30.28,8.77 29.69,8.53 v29.41,8.43
GP42_I2S_2_RXD  (via drill 0.33)
  Top 0.152: J1.50 30.22,9.57 29.69,9.5 29.11,9.5 v27.23,9.37 26.16,9.53 25.58,10.16 25.58,10.54 25.15,10.92 24.51,10.92 22.22,13.21 | 12.45,41.78 12.07,42.16 11.81,42.16 11.43,42.55 10.54,42.55 10.16,42.93 9.53,42.93 9.14,43.31 8.38,43.31 8,43.69 6.98,43.69 6.6,44.07 5.84,44.07 4.19,45.72 4.19,47.62 4.7,48.13 4.7,51.05 5.21,51.56 10.92,51.56 11.94,50.55 12.83,50.55 13.21,50.16 13.84,50.16 U$1.P$50
  Top 0.178: 22.22,13.21 22.22,15.37 21.97,15.62 21.97,20.83 22.1,20.95 22.1,21.72 22.73,22.35 22.73,36.7 20.07,39.37 19.05,39.37 18.16,40.26 17.4,40.26 17.02,40.64 16,40.64 15.62,41.02 14.86,41.02 14.48,41.4 13.89,41.4 13.51,41.78 12.45,41.78
  Bottom 0.152: v27.23,9.37 29.11,9.5 29.69,9.5 30.22,9.57 J1.50
GP43_I2S_2_TXD  (via drill 0.33)
  Top 0.152: J1.56 30.44,8.37 29.74,7.72 29.18,7.72 28.93,7.77 v25.48,7.77 24.61,8.18 24.59,9.78 24.13,9.78 21.08,12.83 | 9.14,41.78 8.76,42.16 8,42.16 7.62,42.55 6.6,42.55 6.22,42.93 5.46,42.93 3.05,45.34 3.05,48.01 3.56,48.51 3.56,51.44 4.83,52.7 11.3,52.7 12.32,51.69 13.21,51.69 13.59,51.31 14.22,51.31 14.73,50.8 15.37,50.8 15.75,50.42 16.64,50.42 17.02,50.04 17.78,50.04 U$1.P$56
  Top 0.178: 21.08,12.83 21.08,14.99 20.83,15.24 20.83,21.21 20.95,21.34 20.95,22.1 21.59,22.73 21.59,36.32 19.68,38.23 18.67,38.23 17.78,39.12 16.89,39.12 16.51,39.5 15.62,39.5 15.24,39.88 14.48,39.88 14.1,40.26 13.46,40.26 13.08,40.69 12.12,40.69 11.74,40.97 11.43,40.97 11.05,41.4 10.16,41.4 9.78,41.78 9.14,41.78
  Bottom 0.152: v25.48,7.77 28.93,7.77 29.18,7.72 29.74,7.72 30.44,8.37 J1.56
GP44  (via drill 0.33)
  Top 0.152: J1.24 30.72,14.77 30.43,14.58 28.42,14.58 v28.04,14.91 27.89,14.96 27.56,15.16 26.42,16.2 26.31,16.71 26.16,17.02 26.16,19.43 26.29,19.56 26.29,20.32 26.92,20.95 26.92,39.75 | U$1.P$24 13.46,46.35 13.84,45.97 14.86,45.97 15.24,45.59 15.88,45.59 16.26,45.21 17.02,45.21 17.4,44.83 18.41,44.83 18.8,44.45 19.56,44.45 20.45,43.56 22.48,43.56 23.49,42.55 24,42.55 24,41.02
  Top 0.178: 24,41.02 25.27,39.75 26.92,39.75
  Bottom 0.152: J1.24 30.72,14.77 30.43,14.58 28.42,14.58 v28.04,14.91
GP45  (via drill 0.33)
  Top 0.152: J1.26 30.75,14.37 30.58,14.25 27.69,14.25 v26.97,14.88 26.67,15.19 26.67,15.49 26.09,15.98 25.98,16.48 25.78,16.89 25.78,19.56 25.91,19.68 25.91,20.45 26.54,21.08 26.54,39.37 | U$1.P$26 12.32,46.74 13.08,45.97 13.34,45.97 13.72,45.59 14.73,45.59 15.11,45.21 15.75,45.21 16.13,44.83 16.89,44.83 17.27,44.45 18.29,44.45 18.67,44.07 19.43,44.07 20.32,43.18 22.35,43.18 23.37,42.16 23.62,42.16 23.62,40.89
  Top 0.178: 23.62,40.89 25.15,39.37 26.54,39.37
  Bottom 0.152: J1.26 30.75,14.37 | 30.75,14.37 | 30.75,14.37 30.73,14.37 30.56,14.25 27.71,14.25 v26.97,14.88
GP46  (via drill 0.33)
  Top 0.152: U$1.P$28 11.68,45.97 12.57,45.97 12.95,45.59 13.21,45.59 13.59,45.21 14.61,45.21 14.99,44.83 15.62,44.83 16,44.45 16.76,44.45 17.14,44.07 18.16,44.07 18.54,43.69 19.3,43.69 20.19,42.8 22.22,42.8 23.24,41.78 | 26.16,38.99 26.16,21.21 25.53,20.57 25.53,19.81 25.4,19.68 25.4,16.76 25.7,16.15 v25.91,15.27 26.24,14.94 26.24,14.73 26.7,14.33 27.05,14.28 27.25,14.12 27.46,13.92 30.71,13.92 30.81,13.97 J1.28
  Top 0.178: 23.24,41.78 23.24,40.77 25.02,38.99 26.16,38.99
  Bottom 0.152: 25.93,15.27 v25.91,15.27 26.24,14.94 26.24,14.73 26.7,14.33 27.1,14.28 27.46,13.92 30.71,13.92 30.81,13.97 J1.28
GP47  (via drill 0.33)
  Top 0.152: J1.30 30.82,13.57 30.81,13.56 26.8,13.56 26.77,13.64 v26.77,13.72 26.47,13.97 25.53,13.97 25.27,14.22 25.27,16.18 25.02,16.64 25.02,19.81 25.15,19.94 25.15,20.7 25.78,21.34 25.78,38.61 | U$1.P$30 9.78,46.74 10.54,45.97 11.18,45.97 11.56,45.59 12.45,45.59 12.83,45.21 13.08,45.21 13.46,44.83 14.48,44.83 14.86,44.45 15.49,44.45 15.88,44.07 16.64,44.07 17.02,43.69 18.03,43.69 18.41,43.31 19.18,43.31 20.07,42.42 22.1,42.42 22.86,41.66
  Top 0.178: 22.86,41.66 22.86,40.64 24.89,38.61 25.78,38.61
  Bottom 0.152: J1.30 30.82,13.57 30.81,13.56 26.92,13.56 v26.77,13.72
GP48  (via drill 0.33)
  Top 0.152: J1.32 30.06,13.17 v29.74,12.95 29.49,13.21 27.3,13.21 27.18,13.08 26.42,13.08 26.16,13.34 26.16,13.59 25.4,13.59 24.89,14.1 24.89,16 24.64,16.51 24.64,19.94 24.77,20.07 24.77,20.83 25.4,21.46 25.4,38.23 | U$1.P$32 8.51,46.74 9.27,45.97 10.03,45.97 10.41,45.59 11.05,45.59 11.43,45.21 12.32,45.21 12.7,44.83 12.95,44.83 13.34,44.45 14.35,44.45 14.73,44.07 15.37,44.07 15.75,43.69 16.51,43.69 16.89,43.31 17.91,43.31 18.29,42.93 19.05,42.93 19.94,42.04
  Top 0.178: 19.94,42.04 21.97,42.04 22.48,41.53 22.48,40.51 24.77,38.23 25.4,38.23
  Bottom 0.152: J1.32 30.06,13.17 v29.74,12.95
GP49  (via drill 0.33 pad 0.25)
  Top 0.152: 25.02,37.85 25.02,21.59 24.38,20.95 24.38,20.19 24.26,20.07 24.26,16.48 24.51,15.98 24.51,13.97 25.27,13.21 25.78,13.21 26.29,12.7 27.3,12.7 27.43,12.57 v27.61,12.62 27.81,12.83 28.83,12.83 29.34,12.32 30.1,12.32 30.55,12.77 30.61,12.77 | 19.81,41.66 18.92,42.55 18.16,42.55 17.78,42.93 16.76,42.93 16.38,43.31 15.62,43.31 15.24,43.69 14.61,43.69 14.22,44.07 13.21,44.07 12.83,44.45 12.57,44.45 12.19,44.83 11.3,44.83 10.92,45.21 10.29,45.21 9.91,45.59 9.14,45.59 8.76,45.97 7.75,45.97 7.75,46.1 U$1.P$34 | J1.34 30.61,12.77 | 30.61,12.77
  Top 0.178: 25.02,37.85 24.64,37.85 22.1,40.39 22.1,41.4 21.84,41.66 19.81,41.66
  Bottom 0.152: J1.34 30.55,12.77 30.1,12.32 29.34,12.32 28.83,12.83 27.81,12.83 v27.61,12.62
GP77_SD_0_CD#  (via drill 0.33)
  Top 0.152: J1.60 30.51,7.57 29.97,7.04 29.67,7.04 v29.23,6.6
  Bottom 0.152: 29.06,6.38 29.67,7.04 29.97,7.04 30.5,7.57 J1.60 | U$1.P$60 21.08,49.4 20.32,50.16 6.6,50.16 6.22,49.78 6.22,47.75 5.59,47.12 5.59,46.1 6.35,45.34 17.14,45.34 19.94,42.55 19.94,14.99 | 23.88,7.87 25.32,6.43 25.42,6.43 29.06,6.38 | 29.06,6.38 v29.23,6.6
  Bottom 0.178: 19.94,14.99 20.19,14.73 20.19,12.57 23.75,9.02 23.88,9.02 23.88,7.87
GP78_SD_0_CLK  (via drill 0.33)
  Top 0.152: J1.58 30.47,7.97 29.87,7.37 29.01,7.37 v28.3,7.04
  Bottom 0.152: J1.58 30.47,7.97 29.87,7.37 29.06,7.37 v28.3,7.04 25.63,7.06 25.25,7.06 24.26,7.95 24.26,9.4 23.88,9.4 | U$1.P$58 19.81,49.02 19.18,48.39 7.49,48.39 6.1,46.99 6.1,46.23 6.6,45.72 17.27,45.72 20.32,42.67 20.32,15.11
  Bottom 0.178: 20.32,15.11 20.57,14.86 20.57,12.7 23.88,9.4
GP79_SD_0_CMD  (via drill 0.33)
  Top 0.152: J1.62 30.54,7.17 30.02,6.66 30.02,6.45 29.52,5.94 v24.92,5.94
  Bottom 0.152: J1.62 30.54,7.17 30.02,6.66 30.02,6.45 29.52,5.94 v24.92,5.94 24.51,6.4 24.51,6.73 23.49,7.75 | U$1.P$62 22.35,49.53 21.59,50.29 20.95,50.29 20.7,50.55 6.48,50.55 5.84,49.91 5.84,47.88 5.21,47.24 5.21,45.97 6.22,44.96 17.02,44.96 19.56,42.42 19.56,14.86
  Bottom 0.178: 19.56,14.86 19.81,14.61 19.81,12.45 23.49,8.76 23.49,7.75
GP80_SD_0_DAT0  (via drill 0.33)
  Top 0.152: J1.66 30.8,6.37 29.49,4.93 29.23,4.93 28.93,4.62 26.49,4.62 v26.42,4.7
  Bottom 0.152: J1.66 30.83,6.37 29.49,4.93 29.23,4.93 28.9,4.6 27.18,4.6 27.05,4.62 26.49,4.62 v26.42,4.7 26.09,4.37 25.09,4.37 23.75,5.71 | U$1.P$66 24.89,49.66 24.38,50.16 23.49,50.16 22.35,51.31 6.22,51.31 5.08,50.16 5.08,48.13 4.44,47.5 4.44,45.72 5.97,44.2 16.76,44.2 18.8,42.16 18.8,14.61
  Bottom 0.178: 18.8,14.61 19.05,14.35 19.05,12.19 22.73,8.51 22.73,7.49 23.75,6.48 23.75,5.71
GP81_SD_0_DAT1  (via drill 0.33)
  Top 0.152: J1.70 30.94,5.57 30.76,5.38 30.76,4.98 30.48,4.75 v30.35,3.79
  Bottom 0.152: J1.70 30.95,5.57 30.76,5.38 30.76,4.98 30.48,4.75 v30.35,3.79 30.07,3.71 24.69,3.71 24.38,4.01 24.13,4.32 22.99,5.46 | U$1.P$70 27.43,49.4 26.67,50.16 25.78,50.16 25.02,50.93 23.88,50.93 22.73,52.07 5.97,52.07 4.32,50.42 4.32,48.39 3.68,47.75 3.68,45.47 5.71,43.43 16.51,43.43 18.03,41.91
  Bottom 0.178: 18.03,41.91 18.03,14.35 18.29,14.1 18.29,11.94 21.97,8.26 21.97,7.24 22.99,6.22 22.99,5.46
GP82_SD_0_DAT2  (via drill 0.33)
  Top 0.152: J1.64 30.72,6.77 30.48,6.48 30.33,6.3 29.52,5.44 25.53,5.44 v25.48,5.16
  Bottom 0.152: J1.64 30.72,6.72 30.48,6.48 30.33,6.3 29.52,5.44 25.53,5.44 v25.48,5.16 25.48,5.36 24.61,5.36 24.13,5.84 24.13,6.6 23.11,7.62 | U$1.P$64 23.62,49.4 22.73,50.29 22.22,50.29 21.84,50.67 21.08,50.67 20.83,50.93 6.35,50.93 5.46,50.04 5.46,48.01 4.83,47.37 4.83,45.85 6.1,44.58 16.89,44.58 19.18,42.29 19.18,14.73
  Bottom 0.178: 19.18,14.73 19.43,14.48 19.43,12.32 23.11,8.64 23.11,7.62
GP83_SD_0_DAT3  (via drill 0.33)
  Top 0.152: v29.59,4.34 30.38,5.44 30.91,5.97 J1.68
  Bottom 0.152: J1.68 30.91,5.97 30.38,5.44 v29.59,4.34 29.31,4.06 26.97,4.06 26.59,4.04 24.92,4.04 23.37,5.59 | U$1.P$68 24.89,50.55 23.75,50.55 22.61,51.69 6.1,51.69 4.7,50.29 4.7,48.26 4.06,47.62 4.06,45.59 5.84,43.81 16.64,43.81 18.41,42.04
  Bottom 0.178: 18.41,42.04 18.41,14.48 18.67,14.22 18.67,12.06 22.35,8.38 22.35,7.37 23.37,6.35 23.37,5.59
GP84_SD_CLK_FB  (via drill 0.33)
  Top 0.152: J1.44 30.86,10.77 30.79,10.79 30.28,10.79 29.87,11.12 v27.41,11.1 27.36,11.3 27.05,11.3 26.8,11.56 25.96,11.56 25.45,12.06 24.89,12.06 23.37,13.59 | U$1.P$44 10.92,49.66 10.16,50.42 5.84,50.42 5.84,47.75 5.33,47.24 5.33,46.1 6.22,45.21 6.98,45.21 7.37,44.83 8.38,44.83 8.76,44.45 9.53,44.45 9.91,44.07 10.54,44.07 10.92,43.69 11.81,43.69 12.19,43.31 12.45,43.31 12.83,42.93 13.84,42.93 14.22,42.55 14.86,42.55 15.24,42.16 16,42.16 16.38,41.78
  Top 0.178: 16.38,41.78 17.4,41.78 17.78,41.4 18.54,41.4 19.43,40.51 20.95,40.51 20.95,40.01 23.88,37.08 23.88,21.97 23.24,21.34 23.24,20.57 23.11,20.45 23.11,16 23.37,15.75 23.37,13.59
  Bottom 0.152: v27.41,11.1 29.87,11.12 30.28,10.79 30.79,10.79 30.86,10.77 J1.44 | J1.44
GP109_SPI_2_CLK  (via drill 0.33)
  Top 0.152: J2.55 35.37,8.37 35.71,8.08 36.53,8.08 37.14,8.51 38.89,8.51 v39.57,7.98 40.36,8.76 42.16,8.76 43.94,10.54 43.94,12.45 44.2,12.7 44.2,14.86 44.58,15.24 44.58,19.94 43.43,21.08 43.43,21.72 42.93,22.23 42.93,22.86 | U$1.P$55 37.59,49.53 38.23,50.16 39.12,50.16 40.13,51.18 42.93,51.18 43.18,51.44 43.82,51.44 44.2,51.82 44.96,51.82 45.34,52.2 46.23,52.2 46.61,52.58 47.37,52.58 47.62,52.83 50.42,52.83 52.96,50.29 52.96,45.47 49.91,42.42 48.64,42.42 48.26,42.04
  Top 0.178: 48.26,42.04 47.5,42.04 47.12,41.66 46.36,41.66 45.97,41.27 45.09,41.27 44.7,40.89 44.07,40.89 43.69,40.51 42.93,40.51 42.55,40.13 42.09,40.13 42.09,35.94 38.48,32.28 38.48,27.3 42.93,22.86
  Bottom 0.152: J2.55 35.37,8.37 35.71,8.08 36.53,8.08 37.14,8.51 38.89,8.51 v39.57,7.98
GP110_SPI_2_FS0  (via drill 0.33 pad 0.25)
  Top 0.152: U$1.P$53 38.86,49.4 40.26,50.8 43.05,50.8 43.31,51.05 43.94,51.05 44.32,51.44 45.09,51.44 45.47,51.82 46.36,51.82 46.74,52.2 47.5,52.2 47.75,52.45 50.29,52.45 52.58,50.16 52.58,45.59 49.78,42.8 48.51,42.8 48.13,42.42 47.37,42.42 46.99,42.04 | 42.55,22.73 42.55,22.1 43.05,21.59 43.05,20.95 44.2,19.81 44.2,15.37 43.82,14.99 43.82,12.83 43.56,12.57 43.56,10.67 42.04,9.14 39.88,9.14 v39.62,8.89 39.5,9.02 38.48,9.02 38.35,8.89 36.83,8.89 36.32,8.38 35.87,8.38 35.48,8.77 J2.53
  Top 0.178: 46.99,42.04 46.23,42.04 45.85,41.66 44.96,41.66 44.58,41.27 43.94,41.27 43.56,40.89 42.8,40.89 42.42,40.51 41.96,40.51 41.76,40.31 41.76,36.17 38.1,32.46 38.1,27.18 42.55,22.73
  Bottom 0.152: J2.53 35.48,8.77 35.87,8.38 36.32,8.38 36.83,8.89 38.35,8.89 38.48,9.02 39.5,9.02 v39.62,8.89
GP111_SPI_2_FS1  (via drill 0.33)
  Top 0.152: J2.51 35.94,9.17 v36.12,9.04 36.4,9.27 38.1,9.27 38.35,9.53 41.91,9.53 43.18,10.79 43.18,12.7 43.43,12.95 43.43,15.11 43.82,15.49 43.82,19.68 42.67,20.83 42.67,21.46 42.16,21.97 42.16,22.61 37.72,27.05 | U$1.P$51 40.13,49.53 41.02,50.42 43.18,50.42 43.43,50.67 44.07,50.67 44.45,51.05 45.21,51.05 45.59,51.44 46.48,51.44 46.86,51.82 47.62,51.82 47.88,52.07 50.16,52.07 52.2,50.04 52.2,45.72 49.66,43.18 48.39,43.18 48.01,42.8 47.24,42.8 46.86,42.42 46.1,42.42 45.72,42.04
  Top 0.178: 45.72,42.04 44.83,42.04 44.45,41.66 43.82,41.66 43.43,41.27 42.67,41.27 42.29,40.89 41.86,40.89 41.43,40.46 41.43,36.35 37.72,32.59 37.72,27.05
  Bottom 0.152: J2.51 35.94,9.17 v36.12,9.04
GP114_SPI_2_RXD  (via drill 0.33)
  Top 0.152: J2.59 35.3,7.57 35.46,7.42 37.29,7.42 v37.67,7.19
  Bottom 0.152: J2.59 35.3,7.57 35.46,7.42 37.29,7.42 v37.67,7.19 37.72,7.11 39.62,7.11 40.64,8.13 40.64,10.03 41.91,11.3 41.91,11.94 40.26,13.59 40.26,18.03 37.21,21.08 35.69,21.08 33.15,23.62 33.15,44.83 37.34,44.83 38.1,45.59 49.28,45.59 49.91,46.23 49.91,47.24 49.02,48.13 35.05,48.13 U$1.P$59
GP115_SPI_2_TXD  (via drill 0.33)
  Top 0.152: J2.57 35.34,7.97 35.59,7.77 36.65,7.77 37.01,7.95 37.74,7.95 v38.33,7.9 38.51,7.37 39.88,7.37 40.26,7.75 40.26,8.13 40.51,8.38 42.29,8.38 44.32,10.41 44.32,12.32 44.58,12.57 44.58,14.73 44.96,15.11 | U$1.P$57 37.59,50.55 38.99,50.55 40.01,51.56 42.8,51.56 43.05,51.82 43.69,51.82 44.07,52.2 44.83,52.2 45.21,52.58 46.1,52.58 46.48,52.96 47.24,52.96 47.5,53.21 | 50.55,53.21 53.34,50.42 53.34,45.34 50.04,42.04 | 43.31,22.99 43.31,22.35 43.82,21.84 43.82,21.21 44.96,20.07
  Top 0.178: 47.5,53.21 50.55,53.21 | 50.04,42.04 48.77,42.04 48.39,41.66 47.62,41.66 47.24,41.27 46.48,41.27 46.1,40.89 45.21,40.89 44.83,40.51 44.2,40.51 43.82,40.13 43.05,40.13 42.67,39.75 42.42,39.75 42.42,35.76 38.86,32.16 38.86,27.43 43.31,22.99 | 44.96,20.07 44.96,15.11
  Bottom 0.152: J2.57 35.34,7.97 35.59,7.77 36.65,7.77 37.01,7.95 37.74,7.95 v38.33,7.9
GP128_UART_1_CTS  (via drill 0.33)
  Top 0.152: J2.65 35.29,6.37 36.22,5.44 v37.06,4.67
  Bottom 0.152: J2.65 35.29,6.37 36.22,5.44 v37.06,4.67 37.08,4.7 37.85,4.7 38.23,5.08 38.23,5.71 38.48,5.97 40.01,5.97 41.78,7.75 41.78,9.65 42.95,10.79 42.95,12.45 41.4,13.97 41.4,18.41 37.59,22.23 36.07,22.23 34.29,24 34.29,43.69 37.72,43.69 38.48,44.45 49.66,44.45 51.11,45.85 51.11,49.66 49.53,51.18 34.67,51.18 34.04,50.55 32.39,50.55 31.24,49.4 U$1.P$65
GP129_UART_1_RTS  (via drill 0.33)
  Top 0.152: v37.44,5.51 36.88,6.1 36.04,6.1 35.37,6.77 J2.63
  Bottom 0.152: J2.63 35.37,6.77 36.04,6.1 36.88,6.1 v37.44,5.51 38.28,6.35 39.88,6.35 41.4,7.87 41.4,9.78 42.65,11.05 42.65,12.19 41.02,13.84 41.02,18.29 37.47,21.84 35.94,21.84 33.91,23.88 33.91,44.07 37.59,44.07 38.35,44.83 49.53,44.83 50.75,46.1 50.75,49.4 49.4,50.8 34.8,50.8 34.16,50.16 33.15,50.16 32.51,49.53 U$1.P$63
GP130_UART_1_RX  (via drill 0.33)
  Top 0.152: v36.32,6.76 35.99,7.09 35.33,7.09 35.25,7.17 J2.61
  Bottom 0.152: J2.61 35.25,7.17 35.33,7.09 35.99,7.09 v36.32,6.76 36.47,6.6 37.97,6.6 38.1,6.73 39.75,6.73 41.02,8 41.02,9.91 42.29,11.18 42.29,12.06 40.64,13.72 40.64,18.16 37.34,21.46 35.81,21.46 33.53,23.75 33.53,44.45 37.47,44.45 38.23,45.21 49.4,45.21 50.42,46.23 50.42,49.28 49.3,50.32 34.9,50.34 U$1.P$61
GP131_UART_1_TX  (via drill 0.33)
  Top 0.152: J1.46 30.9,10.37 30.89,10.39 30.15,10.39 29.74,10.72 29.08,10.67 28.78,10.49 v26.54,10.54 25.4,11.68 24.77,11.68 22.99,13.46 | U$1.P$46 12.07,49.28 10.54,50.8 5.59,50.8 5.46,50.67 5.46,47.88 4.95,47.37 4.95,45.97 6.1,44.83 6.86,44.83 7.24,44.45 8.26,44.45 8.64,44.07 9.4,44.07 9.78,43.69 10.41,43.69 10.79,43.31 11.68,43.31 12.07,42.93 12.32,42.93 12.7,42.55 13.72,42.55 14.1,42.16 14.73,42.16 15.11,41.78
  Top 0.178: 15.11,41.78 15.88,41.78 16.26,41.4 17.27,41.4 17.65,41.02 18.41,41.02 19.3,40.13 20.57,40.13 20.57,39.88 23.49,36.96 23.49,22.1 22.86,21.46 22.86,20.7 22.73,20.57 22.73,15.88 22.99,15.62 22.99,13.46
  Bottom 0.152: v26.54,10.54 28.78,10.49 29.08,10.67 29.74,10.72 30.15,10.39 30.89,10.39 30.9,10.37 J1.46
GP134_UART_2_RX  (via drill 0.33)
  Top 0.152: J1.22 30.18,15.17 v30.1,15.19 30.05,15.14 28.88,15.14 28.52,15.49 27.74,15.49 26.8,16.43 26.59,16.94 26.54,17.14 26.54,19.3 26.67,19.43 26.67,20.19 27.3,20.83 27.3,40.13 | U$1.P$22 15.49,45.97 16,45.97 16.38,45.59 17.14,45.59 17.53,45.21 18.54,45.21 18.92,44.83 19.68,44.83 20.57,43.94 22.61,43.94 23.62,42.93 24.38,42.93 24.38,41.15
  Top 0.178: 24.38,41.15 25.4,40.13 27.3,40.13
  Bottom 0.152: J1.22 30.18,15.17 v30.1,15.19
GP135_UART_2_TX  (via drill 0.33)
  Top 0.152: J2.27 35.46,13.97 35.61,13.87 36.09,13.87 36.73,14.4 36.91,14.4 37.34,14.58 v38.61,14.58 39.24,14.55 39.24,15.11 39.62,15.49 39.62,16.38 40.01,16.76 40.01,18.41 38.86,19.56 38.86,20.19 38.35,20.7 38.35,21.34 33.91,25.78 33.91,43.18 38.1,43.18 39.24,44.32 39.75,44.32 40.13,44.7 41.02,44.7 41.4,45.09 42.16,45.09 42.55,45.47 43.18,45.47 43.56,45.85 44.45,45.85 45.21,46.61 U$1.P$27
  Bottom 0.152: J2.27 35.46,13.97 35.61,13.87 36.09,13.87 36.73,14.4 36.91,14.4 37.34,14.58 v38.61,14.58
GP165  (via drill 0.33)
  Top 0.152: J2.25 35.76,14.37 v35.87,14.48 36.12,14.73 36.6,14.73 36.88,15.01 38.12,15.01 38.35,15.19 38.86,15.19 39.24,15.62 39.24,16.51 39.62,16.89 39.62,18.29 38.48,19.43 38.48,20.07 37.97,20.57 37.97,21.21 33.53,25.65 33.53,43.56 37.97,43.56 39.12,44.7 39.62,44.7 40.01,45.09 40.89,45.09 41.28,45.47 42.04,45.47 42.42,45.85 43.05,45.85 U$1.P$25
  Bottom 0.152: J2.25 35.76,14.37 v35.87,14.48
GP182_PWM2  (via drill 0.33)
  Top 0.152: J2.37 35.4,11.97 35.48,11.94 35.99,11.94 36.53,12.34 v37.8,12.34 37.87,12.32 39.62,12.32 41.15,13.84 41.15,15.88 41.53,16.26 41.53,18.92 40.39,20.07 40.39,20.7 39.88,21.21 39.88,21.84 35.43,26.29 | U$1.P$37 49.02,48.01 49.91,47.12 49.91,46.48 49.28,45.85 49.15,45.85 48.77,45.47 47.62,45.47 47.24,45.09 46.48,45.09 46.1,44.7 45.34,44.7 44.96,44.32 44.07,44.32 43.69,43.94 43.05,43.94 42.67,43.56 41.91,43.56 41.53,43.18 40.64,43.18 39.24,41.78
  Top 0.178: 39.24,41.78 39.24,37.21 35.43,33.45 35.43,26.29
  Bottom 0.152: v37.8,12.34 36.53,12.34 35.99,11.94 35.48,11.94 35.4,11.97 J2.37
GP183_PWM3  (via drill 0.33)
  Top 0.152: U$1.P$39 48.64,50.16 49.53,50.16 50.29,49.4 50.29,46.35 49.4,45.47 49.28,45.47 48.9,45.09 47.75,45.09 47.37,44.7 46.61,44.7 46.23,44.32 45.47,44.32 45.09,43.94 44.2,43.94 43.82,43.56 43.18,43.56 42.8,43.18 42.04,43.18 41.66,42.8 40.77,42.8 39.62,41.66 | 35.81,26.42 40.26,21.97 40.26,21.34 40.77,20.83 40.77,20.19 41.91,19.05 41.91,16.13 41.53,15.75 41.53,13.72 41.02,13.21 41.02,12.72 v40.51,12.37 40.49,12.14 40.06,12.14 39.85,11.94 38.53,11.94 38.35,11.76 36.3,11.76 36.11,11.57 J2.39
  Top 0.178: 39.62,41.66 39.62,37.08 35.81,33.33 35.81,26.42
  Bottom 0.152: J2.39 34.99,11.57 35,11.58 36.12,11.58 36.3,11.76 38.35,11.76 38.53,11.94 39.85,11.94 40.06,12.14 40.49,12.14 v40.51,12.37
MSIC_SLP_CLK  (via drill 0.33)
  Top 0.152: J2.7 35.96,17.97 v36.15,17.78 36.58,18.21 36.58,19.43 36.07,19.94 36.07,20.57 31.5,25.15 31.5,45.47 32.51,46.48 U$1.P$7
  Bottom 0.152: J2.7 35.96,17.97 v36.15,17.78
N$2
  Top 0.152: R1.2 28.05,45.61 27.43,46.23 U$1.P$2 U$1.P$4 U$1.P$6
OSC_CLK_OUT  (via drill 0.33)
  Top 0.152: v35.89,4.52 35.61,4.8 35.61,5.56 35.2,5.97 J2.67
  Bottom 0.152: J2.67 35.2,5.97 35.61,5.56 35.61,4.8 v35.89,4.52 36.35,4.06 37.85,4.06 38.61,4.83 38.61,5.59 40.13,5.59 42.16,7.62 42.16,9.53 43.31,10.67 43.31,12.57 41.78,14.1 41.78,18.54 37.72,22.61 36.2,22.61 34.67,24.13 34.67,43.31 37.97,43.31 38.73,44.07 49.91,44.07 51.49,45.59 51.49,49.78 49.66,51.56 34.54,51.56 33.91,50.93 32.13,50.93 31.37,50.16 30.73,50.16 29.97,49.4 U$1.P$67
PSW  (via drill 0.33)
  Top 0.152: J2.21 35.16,15.17 35.43,15.44 36.25,15.44 36.5,15.7 37.52,15.7 v38.12,16.71 38.86,17.25 38.86,17.91 38.48,18.29 38.1,18.29 37.72,18.67 37.72,19.81 37.21,20.32 37.21,20.95 32.77,25.4 32.77,44.32 37.72,44.32 38.86,45.47 39.37,45.47 39.75,45.85 40.64,45.85 41.4,46.61 U$1.P$21
  Bottom 0.152: J2.21 35.16,15.17 35.43,15.44 36.25,15.44 36.5,15.7 37.52,15.7 v38.12,16.71
PWRBTN#  (via drill 0.33)
  Top 0.152: J2.17 35.1,15.97 35.23,16.1 35.97,16.1 v36.96,17.35 36.96,19.56 36.45,20.07 36.45,20.7 32,25.15 32,45.09 37.47,45.09 38.86,46.48 U$1.P$17
  Bottom 0.152: J2.17 35.1,15.97 35.23,16.1 35.97,16.1 v36.96,17.35
RCVR_MODE  (via drill 0.33)
  Top 0.152: v37.44,13.95 36.8,13.95 36.27,13.51 35.31,13.51 34.96,13.17 J2.31 | U$1.P$31 46.48,46.61 45.72,45.85 44.96,45.85 44.58,45.47 43.69,45.47 43.31,45.09 42.67,45.09 42.29,44.7 41.53,44.7 41.15,44.32 40.26,44.32 39.88,43.94 39.37,43.94 38.23,42.8 34.29,42.8 34.29,25.91 38.73,21.46 38.73,20.83 39.24,20.32 39.24,19.68 40.39,18.54 40.39,16.64 40.01,16.26 39.9,14.35 39.5,13.95 v37.44,13.95 | 37.39,13.95 v37.44,13.95
  Bottom 0.152: J2.31 34.96,13.17 35.31,13.51 36.27,13.51 36.8,13.95 v37.44,13.95
RESET_OUT#  (via drill 0.33)
  Top 0.152: J1.36 30.63,12.37 30.2,11.94 28.88,11.94 v28.47,12.19 28.12,12.19 27.94,12.01 27.3,12.01 27.05,12.32 26.16,12.32 25.65,12.83 25.15,12.83 24.13,13.84 24.13,16 23.88,16.26 | U$1.P$36 7.11,48.01 6.1,46.99 6.1,46.35 6.48,45.97 7.24,45.97 7.62,45.59 8.64,45.59 9.02,45.21 9.78,45.21 10.16,44.83 10.79,44.83 11.18,44.45 12.07,44.45 12.45,44.07 12.7,44.07 13.08,43.69 14.1,43.69 14.48,43.31 15.11,43.31 15.49,42.93 16.26,42.93 16.64,42.55 17.65,42.55 18.03,42.16 18.8,42.16 19.68,41.27 | 24.64,37.34 24.64,21.72 24,21.08 24,20.32 23.88,20.19
  Top 0.178: 19.68,41.27 21.72,41.27 21.72,40.26 24.64,37.34 | 23.88,20.19 23.88,16.26
  Bottom 0.152: v28.47,12.19 28.88,11.94 30.2,11.94 30.63,12.37 J1.36
USB_DN  (via drill 0.33)
  Top 0.152: J1.18 30.77,15.97 30.63,16.1 28.88,16.1 28.24,16.74 v28.3,17.04 28.12,17.27 27.56,17.32 27.43,17.4 27.3,17.4 27.3,19.05 27.43,19.18 27.43,19.94 28.07,20.57 28.07,40.89 | U$1.P$18 17.27,46.61 17.91,45.97 18.8,45.97 19.18,45.59 19.94,45.59 20.83,44.7 22.86,44.7 23.88,43.69 25.15,43.69 25.15,41.4
  Top 0.178: 25.15,41.4 25.65,40.89 28.07,40.89
  Bottom 0.152: v28.3,17.04 28.24,16.74 28.88,16.1 30.63,16.1 30.77,15.97 J1.18
USB_DP  (via drill 0.33)
  Top 0.152: J1.16 30.8,16.37 30.76,16.41 29.52,16.41 v29.16,16.76 29.16,16.97 29.21,17.02 28.57,17.65 27.69,17.65 27.69,18.92 27.94,19.18 27.94,19.94 28.57,20.57 28.57,41.27 | 25.53,41.53 25.53,44.07 24,44.07 22.99,45.09 20.95,45.09 20.07,45.97 19.3,45.97 U$1.P$16
  Top 0.178: 28.57,41.27 25.78,41.27 25.53,41.53
  Bottom 0.152: v29.16,16.76 29.52,16.41 30.76,16.41 30.8,16.37 J1.16
USB_ID  (via drill 0.33)
  Top 0.152: J2.3 35.1,18.77 v35.59,19.53 35.64,20.5 31.11,25.02 31.11,45.59 U$1.P$3
  Bottom 0.152: J2.3 35.1,18.77 v35.59,19.53
USB_VBUS  (via drill 0.33)
  Top 0.152: J1.20 30.68,15.57 30.45,15.8 28.24,15.8 v27.46,16.69 27.05,17.09 27,17.25 26.92,17.53 26.92,19.18 27.05,19.3 27.05,20.07 27.69,20.7 27.69,40.51 | U$1.P$20 16,46.61 16.64,45.97 17.27,45.97 17.65,45.59 18.67,45.59 19.05,45.21 19.81,45.21 20.7,44.32 22.73,44.32 23.75,43.31 24.77,43.31 24.77,41.27
  Top 0.178: 24.77,41.27 25.53,40.51 27.69,40.51
  Bottom 0.152: J1.20 30.68,15.57 30.45,15.8 28.24,15.8 v27.46,16.69
V_BAT_BKUP  (via drill 0.33)
  Top 0.152: J2.23 35.24,14.77 35.61,15.09 36.45,15.09 36.73,15.37 38.05,15.37 v38.61,15.93 38.86,16.08 38.86,16.64 39.24,17.02 39.24,18.16 38.1,19.3 38.1,19.94 37.59,20.45 37.59,21.08 33.15,25.53 33.15,43.94 37.85,43.94 38.99,45.09 39.5,45.09 39.88,45.47 40.77,45.47 41.15,45.85 41.91,45.85 42.67,46.61 U$1.P$23
  Bottom 0.152: J2.23 35.24,14.77 35.61,15.09 36.45,15.09 36.7,15.39 38.02,15.39 v38.61,15.93
VSYS  (via drill 0.33)
  Top 0.152: 30.61,19.17 v30.43,19.3 | 31.01,18.77 J1.4 31.07,18.75 v30.43,19.3 | v30.43,19.3 30.48,43.43 30.23,43.69 R1.1
  Top 0.305: J1.2 30.61,19.17 | J1.4 J1.6 | 31.01,18.77 v30.43,19.3
  Bottom 0.152: 30.61,19.17 v30.43,19.3 31.01,18.77 J1.4 | J1.4 | J1.6 31.41,18.37
  Bottom 0.305: 30.61,19.17 J1.2 J1.4 | 31.41,18.37 31.01,18.77

### Text on the board
tPlace: BRIDGE FOR VSYS